# Altium schematic sheet Peripherals.SchDoc
size A4; DocumentNumber: 6; SheetNumber: 6; SheetTotal: 8
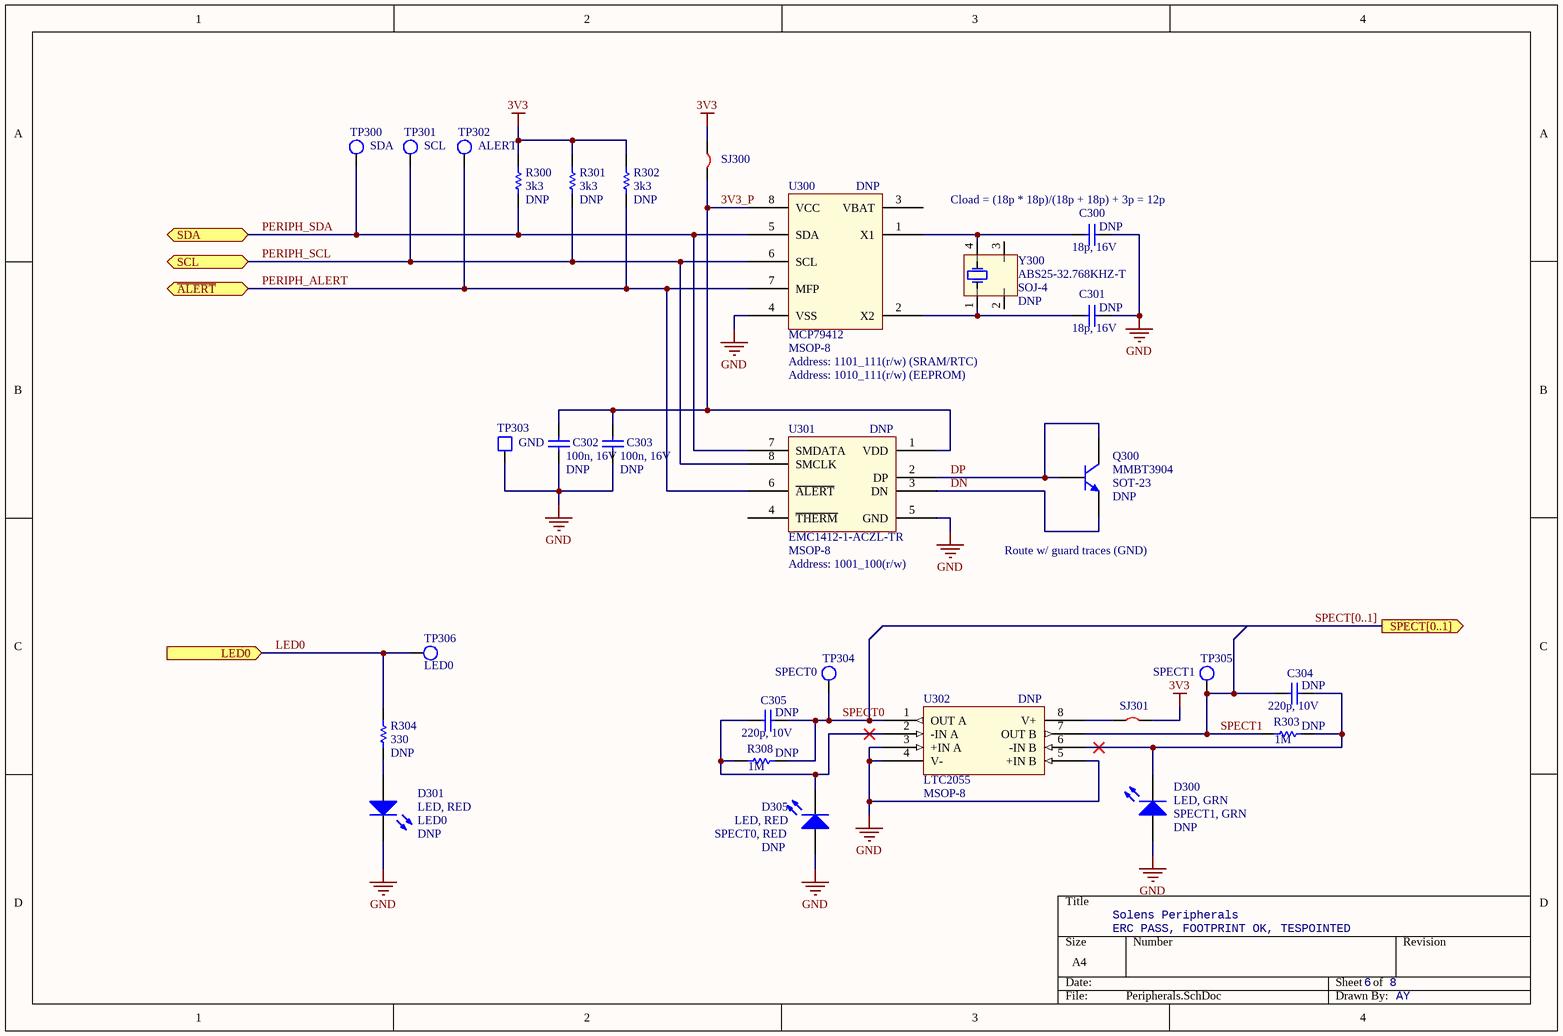
[diagram p0: Peripherals.SchDoc]

## Parts
C300  value 18p, 16V  [CAP_0402]  (hidden comment: 18p, 16V, 0402 (DNP))
C301  value 18p, 16V  [CAP_0402]  (hidden comment: 18p, 16V, 0402 (DNP))
C302  value 100n, 16V  [CAP_0402]  (hidden comment: 100n, 16V, 0402 (DNP))
C303  value 100n, 16V  [CAP_0402]  (hidden comment: 100n, 16V, 0402 (DNP))
C304  value 220p, 10V  [CAP_0402]  (hidden comment: 220p, 16V, 0402 (DNP))
C305  value 220p, 10V  [CAP_0402]  (hidden comment: 220p, 16V, 0402 (DNP))
D300  value LED, GRN  Function: SPECT1, GRN  [LED_0603]  (hidden comment: LED, GRN, 0603 (DNP))
D301  value LED, RED  [LED_0603]  (hidden comment: LED, RED, 0603 (DNP))
D305  value LED, RED  Function: SPECT0, RED  [LED_0603]  (hidden comment: LED, RED, 0603 (DNP))
Q300  PartNumber: MMBT3904  PackageName: SOT-23  [SOT90P240X110-3N]  (hidden comment: MMBT3904, SOT-23 (DNP))
R300  value 3k3  [RES_0805]  (hidden comment: 3k3, 1/8W, 0805 (DNP))
R301  value 3k3  [RES_0805]  (hidden comment: 3k3, 1/8W, 0805 (DNP))
R302  value 3k3  [RES_0805]  (hidden comment: 3k3, 1/8W, 0805 (DNP))
R303  value 1M  [RES_0402]  (hidden comment: 1M, 1/16W, 0402 (DNP))
R304  value 330  [RES_0805]  (hidden comment: 330, 1/8W, 0805 (DNP))
R308  value 1M  [RES_0402]  (hidden comment: 1M, 1/16W, 0402 (DNP))
SJ300  SJ, 0805 (DNP)  [SJ_0805]  (value not drawn)
SJ301  SJ, 0805 (DNP)  [SJ_0805]  (value not drawn)
TP300  VisibleNetName: SDA  [TP_SMALL]  (hidden comment: TP (DNP))
TP301  VisibleNetName: SCL  [TP_SMALL]  (hidden comment: TP (DNP))
TP302  VisibleNetName: ALERT  [TP_SMALL]  (hidden comment: TP (DNP))
TP303  VisibleNetName: GND  [TP_LARGE]  (hidden comment: TP (DNP))
TP304  VisibleNetName: SPECT0  [TP_SMALL]  (hidden comment: TP (DNP))
TP305  VisibleNetName: SPECT1  [TP_SMALL]  (hidden comment: TP (DNP))
TP306  VisibleNetName: LED0  [TP_SMALL]  (hidden comment: TP (DNP))
U300  PackageName: MSOP-8  PartNumber: MCP79412  [TSOP65P490X110-8N]  (hidden comment: MCP79412, MSOP-8 (DNP))
U301  PartNumber: EMC1412-1-ACZL-TR  PackageName: MSOP-8  [TSOP65P490X110-8N]  (hidden comment: EMC1412, MSOP-8 (DNP))
U302  PartNumber: LTC2055  PackageName: MSOP-8  [TSOP65P490X110-8N]  (hidden comment: LTC2055, MSOP-8 (DNP))
Y300  PartNumber: ABS25-32.768KHZ-T  PackageName: SOJ-4  [XTAL-SOJ-4]  (hidden comment: ABS25-32.768KHZ-T (DNP))

## Ports
LED0 (in), SCL (bidir), SDA (bidir), SPECT[0..1] (out), ~{ALERT} (bidir)

## Nets
3V3: R300.1 R301.1 R302.1 SJ300.1 SJ301.2
GND: C300.2 C301.2 C302.2 C303.2 D300.1(A) D301.2(K) D305.1(A) TP303.1 U300.4(VSS) U301.5(GND) U302.3(+IN_A) U302.4(V-) U302.5(+IN_B)
3V3_P: C302.1 C303.1 SJ300.2 U300.8(VCC) U301.1(VDD)
DN: Q300.1(E) U301.3(DN)
DP: Q300.2(B) Q300.3(C) U301.2(DP)
LED0: R304.1 TP306.1 ; port LED0
PERIPH_ALERT: R302.2 TP302.1 U300.7(MFP) U301.6(~{ALERT}) ; port ~{ALERT}
PERIPH_SCL: R301.2 TP301.1 U300.6(SCL) U301.8(SMCLK) ; port SCL
PERIPH_SDA: R300.2 TP300.1 U300.5(SDA) U301.7(SMDATA) ; port SDA
SPECT0: C305.2 R308.2 TP304.1 U302.1(OUT_A)
SPECT1: C304.1 R303.1 TP305.1 U302.7(OUT_B)
NetC300_1: C300.1 U300.1(X1) Y300.4
NetC301_1: C301.1 U300.2(X2) Y300.1
NetC304_2: C304.2 D300.2(K) R303.2 U302.6(-IN_B)
NetC305_1: C305.1 D305.2(K) R308.1 U302.2(-IN_A)
NetD301_1: D301.1(A) R304.2
NetSJ301_1: SJ301.1 U302.8(V+)

Not connected (* = marked no-connect by the designer): U300 3(VBAT); U301 4(~{THERM}); Y300 2 3

## Buses and harness runs
bus SPECT[0..1] = port SPECT[0..1]

## Notes on the sheet
- (near C300) Cload = (18p * 18p)/(18p + 18p) + 3p = 12p
- (near U300) Address: 1101_111(r/w) (SRAM/RTC)
- Address: 1010_111(r/w) (EEPROM)
- (near U301) Address: 1001_100(r/w)
- Route w/ guard traces (GND)
- Solens Peripherals
- ERC PASS, FOOTPRINT OK, TESPOINTED
- AY

## Library data of the parts
C300-C305 = Cap: Capacitor; DNP: DNP
  C300 C301: DigikeyPN: 490-6203-1-ND
  C302 C303: DigikeyPN: 587-3498-1-ND
  C304 C305: DigikeyPN: 490-1293-1-ND
D300 D301 D305 = LED0: Typical INFRARED GaAs LED; DNP: DNP
  D300: DigikeyPN: 732-4971-1-ND
  D301: DigikeyPN: 732-4978-1-ND; Function: LED0
  D305: DigikeyPN: 732-4978-1-ND
Q300 = 2N3904: NPN General Purpose Amplifier; DigikeyPN: MMBT3904LT1GOSCT-ND; DNP: DNP; Value: MMBT3904
R300-R304 R308 = Res1: Resistor; DNP: DNP
  R300-R302: DigikeyPN: 311-3.30KCRCT-ND
  R303 R308: DigikeyPN: 311-1.00MLRCT-ND
  R304: DigikeyPN: 311-330CRCT-ND
SJ300 SJ301 = SJ: Solder jumper; Value: SJ_0805 (DNP); DNP: DNP
TP300-TP302 TP304-TP306 = TP_SMALL: Value: TP_SMALL (DNP); DigikeyPN: 36-5015CT-ND; DNP: DNP
TP303 = TP_LARGE: Value: TP_LARGE (DNP); DigikeyPN: 36-5016CT-ND; DNP: DNP
U300 = MCP7941x: I2C RTC w/ SRAM and EEPROM; DigikeyPN: MCP79412-I/MS-ND; DNP: DNP; Value: MCP79412
U301 = EMC1412: Dual channel I2C temperature sensor; DigikeyPN: 638-1120-1-ND; DNP: DNP; Value: EMC1412
U302 = LTC2054/LTC2055: Dual zero-drift op amp; DigikeyPN: LTC2055HMS8#PBF-ND; DNP: DNP; Value: LTC2055
Y300 = XTAL-SOJ-4: LoadCapacitance: 12.5p; Value: 32k768; DigikeyPN: 535-9166-1-ND; DNP: DNP